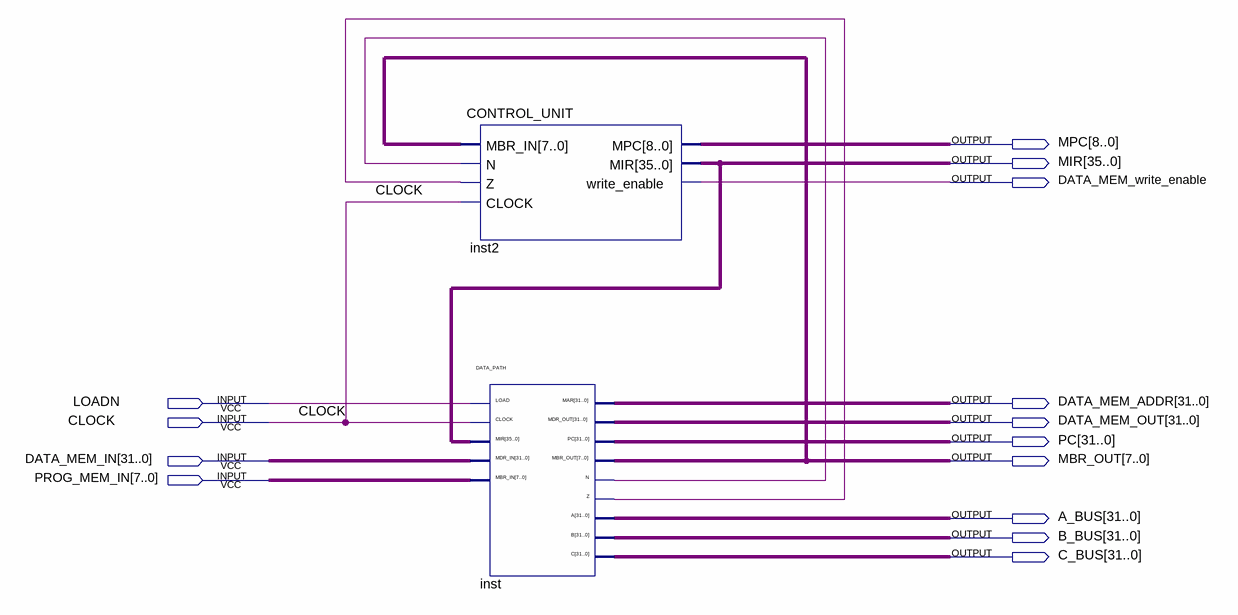
[diagram p0: schematic sheet]
// Quartus schematic CPU.bdf as structural Verilog: 2 symbols, 14 pins
module CPU (
  input  LOADN,
  input  CLOCK,
  input  [31:0] DATA_MEM_IN,
  input  [7:0] PROG_MEM_IN,
  output [8:0] MPC,
  output [35:0] MIR,
  output DATA_MEM_write_enable,
  output [31:0] DATA_MEM_ADDR,
  output [31:0] DATA_MEM_OUT,
  output [31:0] PC,
  output [7:0] MBR_OUT,
  output [31:0] A_BUS,
  output [31:0] B_BUS,
  output [31:0] C_BUS
);

  wire inst_n, inst_z;

  CONTROL_UNIT inst2 (
    .MBR_IN(MBR_OUT), .N(inst_n), .Z(inst_z), .CLOCK(CLOCK), .MPC(MPC), .MIR(MIR),
    .write_enable(DATA_MEM_write_enable));
  DATA_PATH inst (
    .LOAD(LOADN), .CLOCK(CLOCK), .MIR(MIR), .MDR_IN(DATA_MEM_IN), .MBR_IN(PROG_MEM_IN), .MAR(DATA_MEM_ADDR),
    .MDR_OUT(DATA_MEM_OUT), .PC(PC), .MBR_OUT(MBR_OUT), .N(inst_n), .Z(inst_z), .A(A_BUS), .B(B_BUS),
    .C(C_BUS));
endmodule
